# EAGLE board soundcard (EAGLE 6.5.0), part 1 of 3
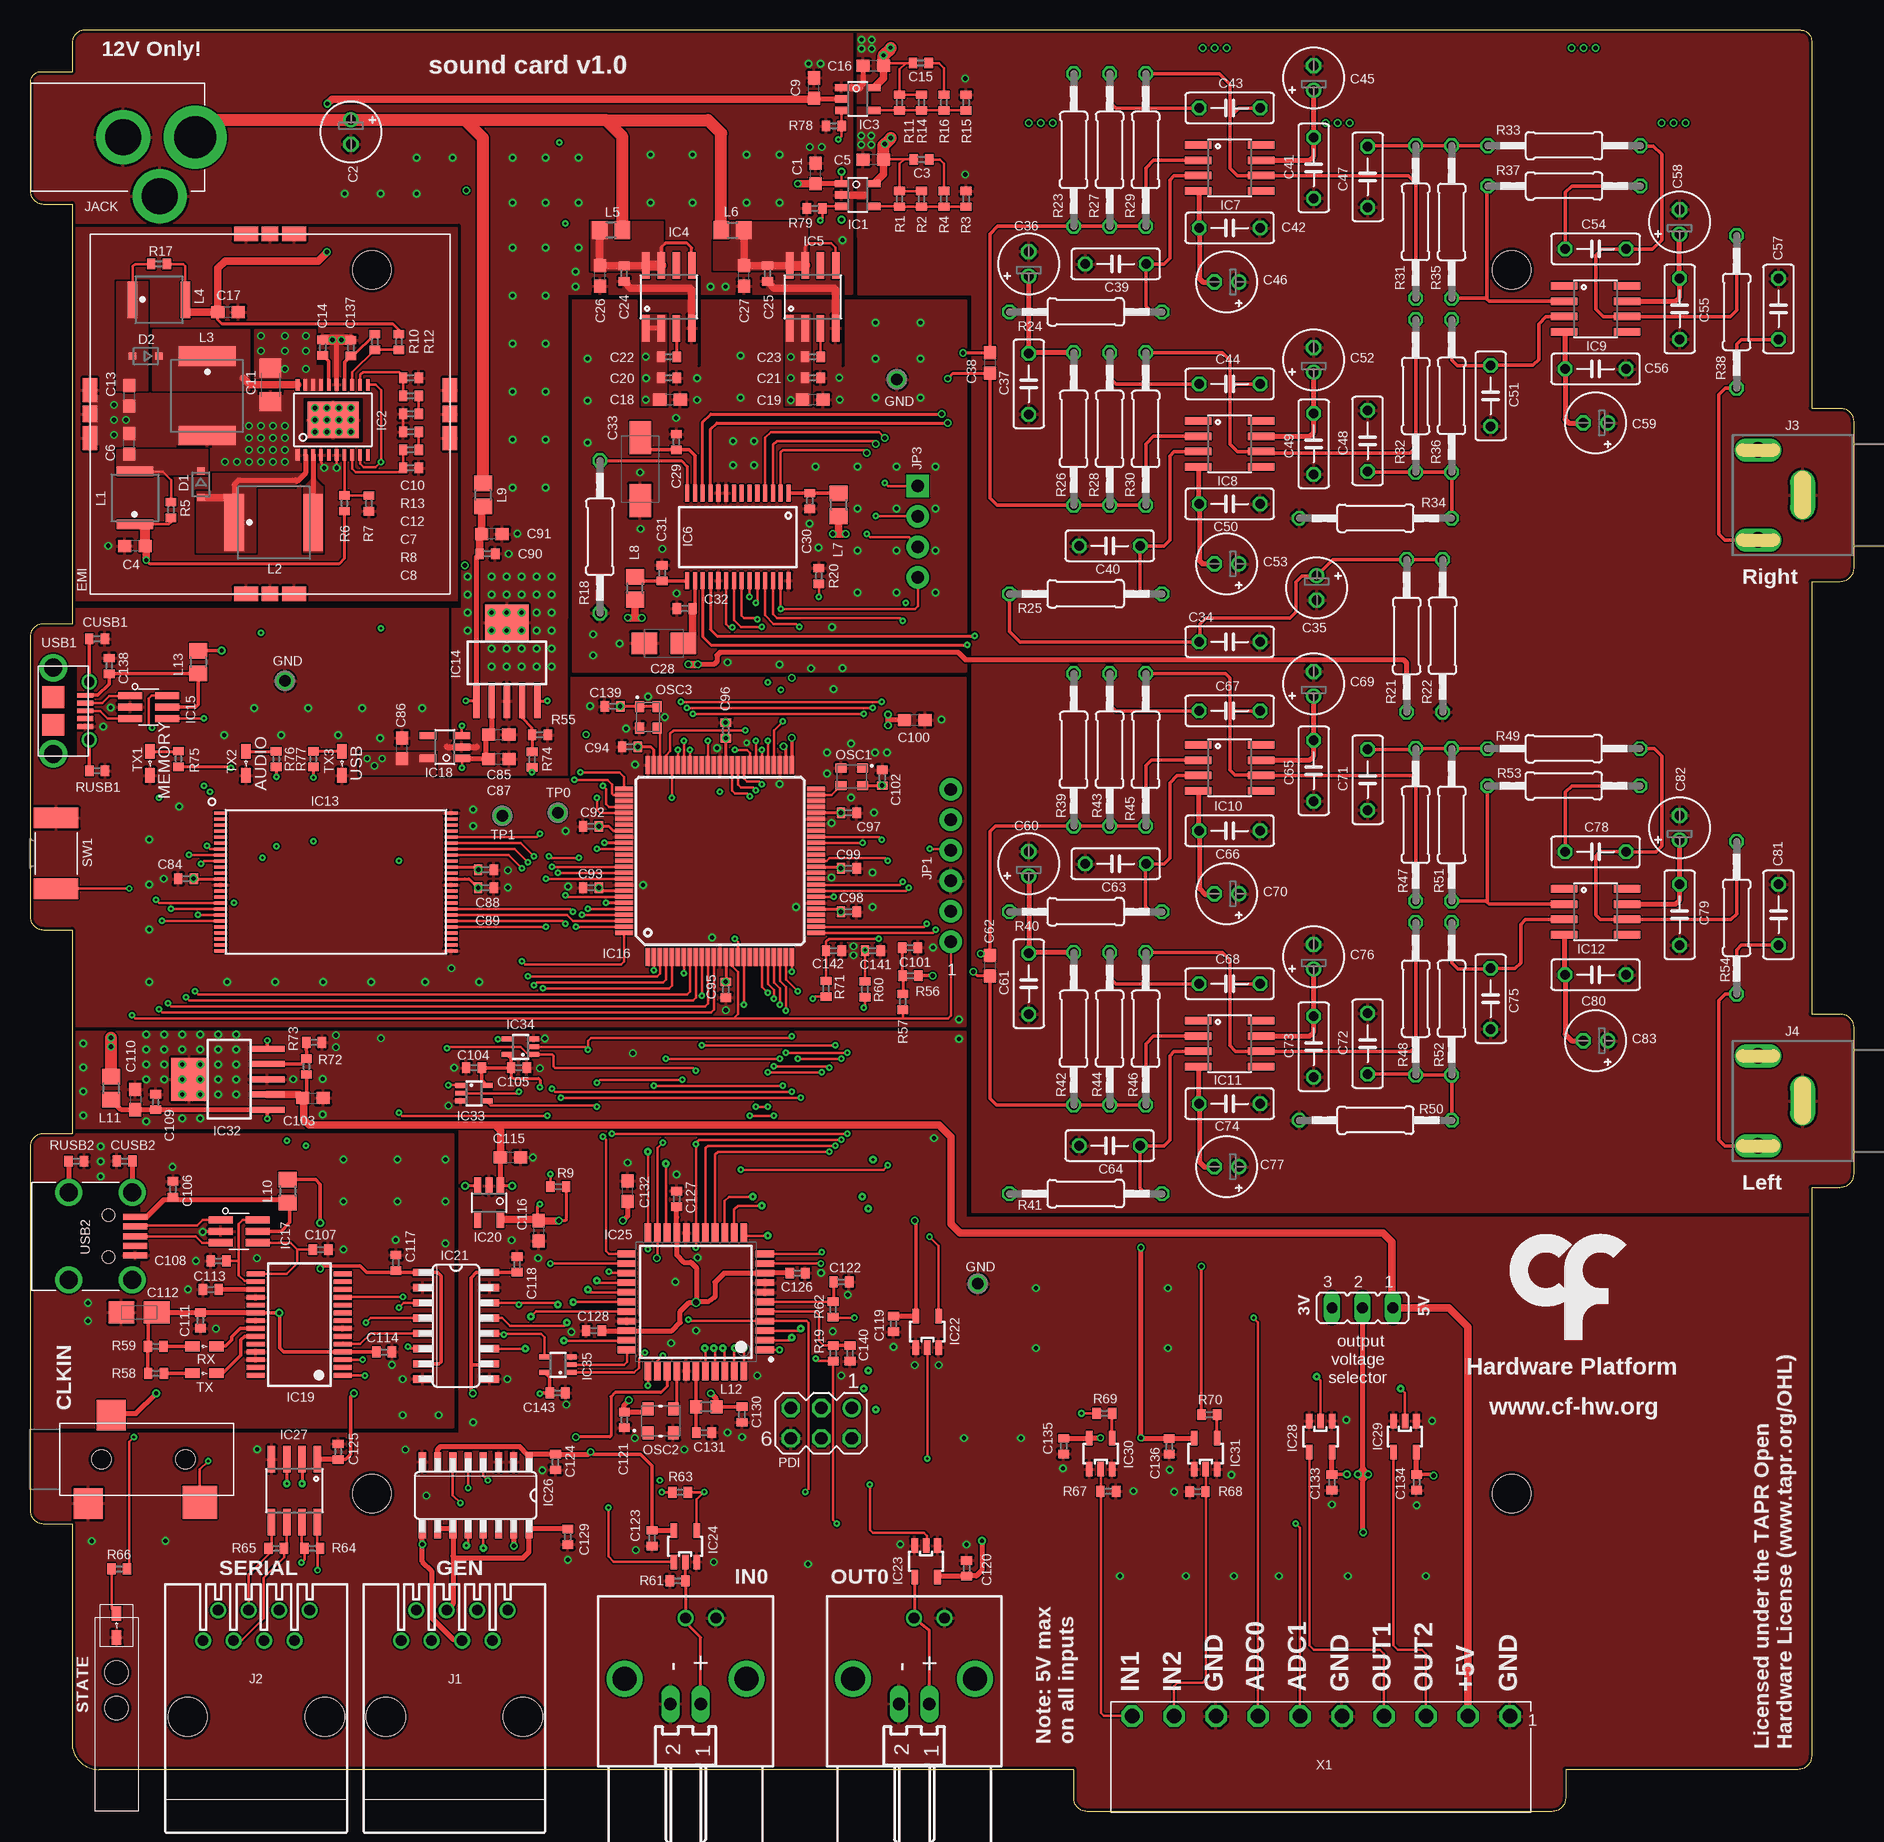
[diagram p8: board, top side]
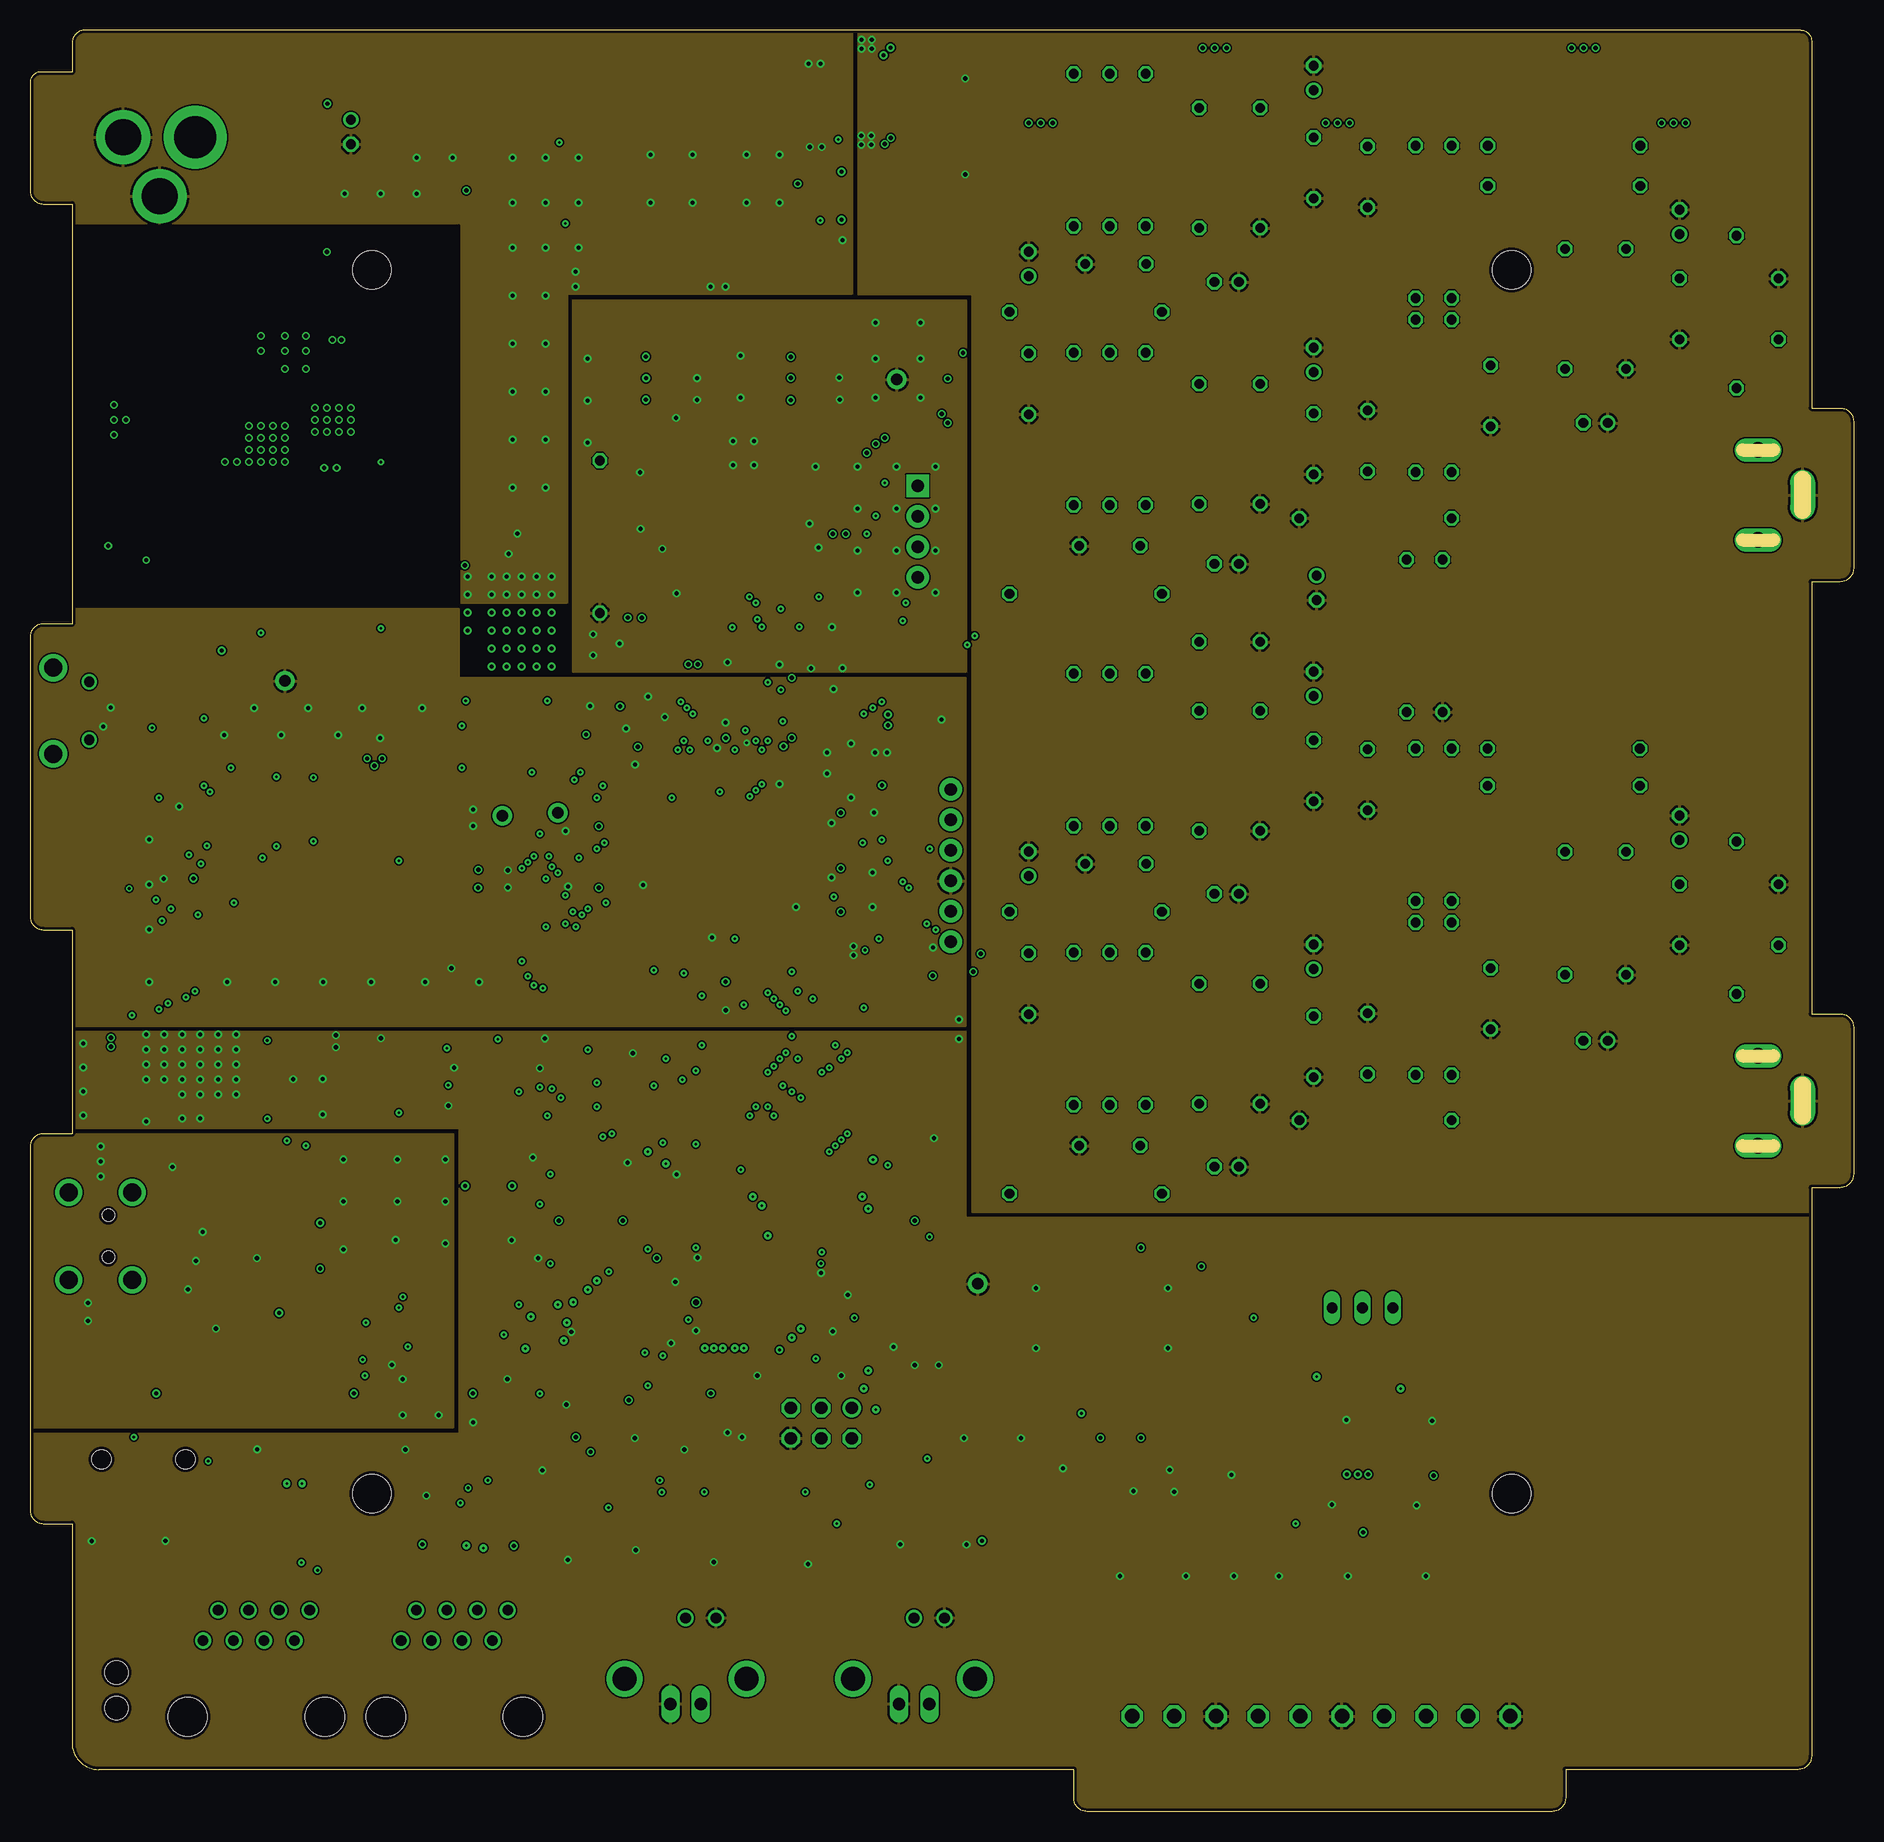
[diagram p9: board, inner layer Route2]
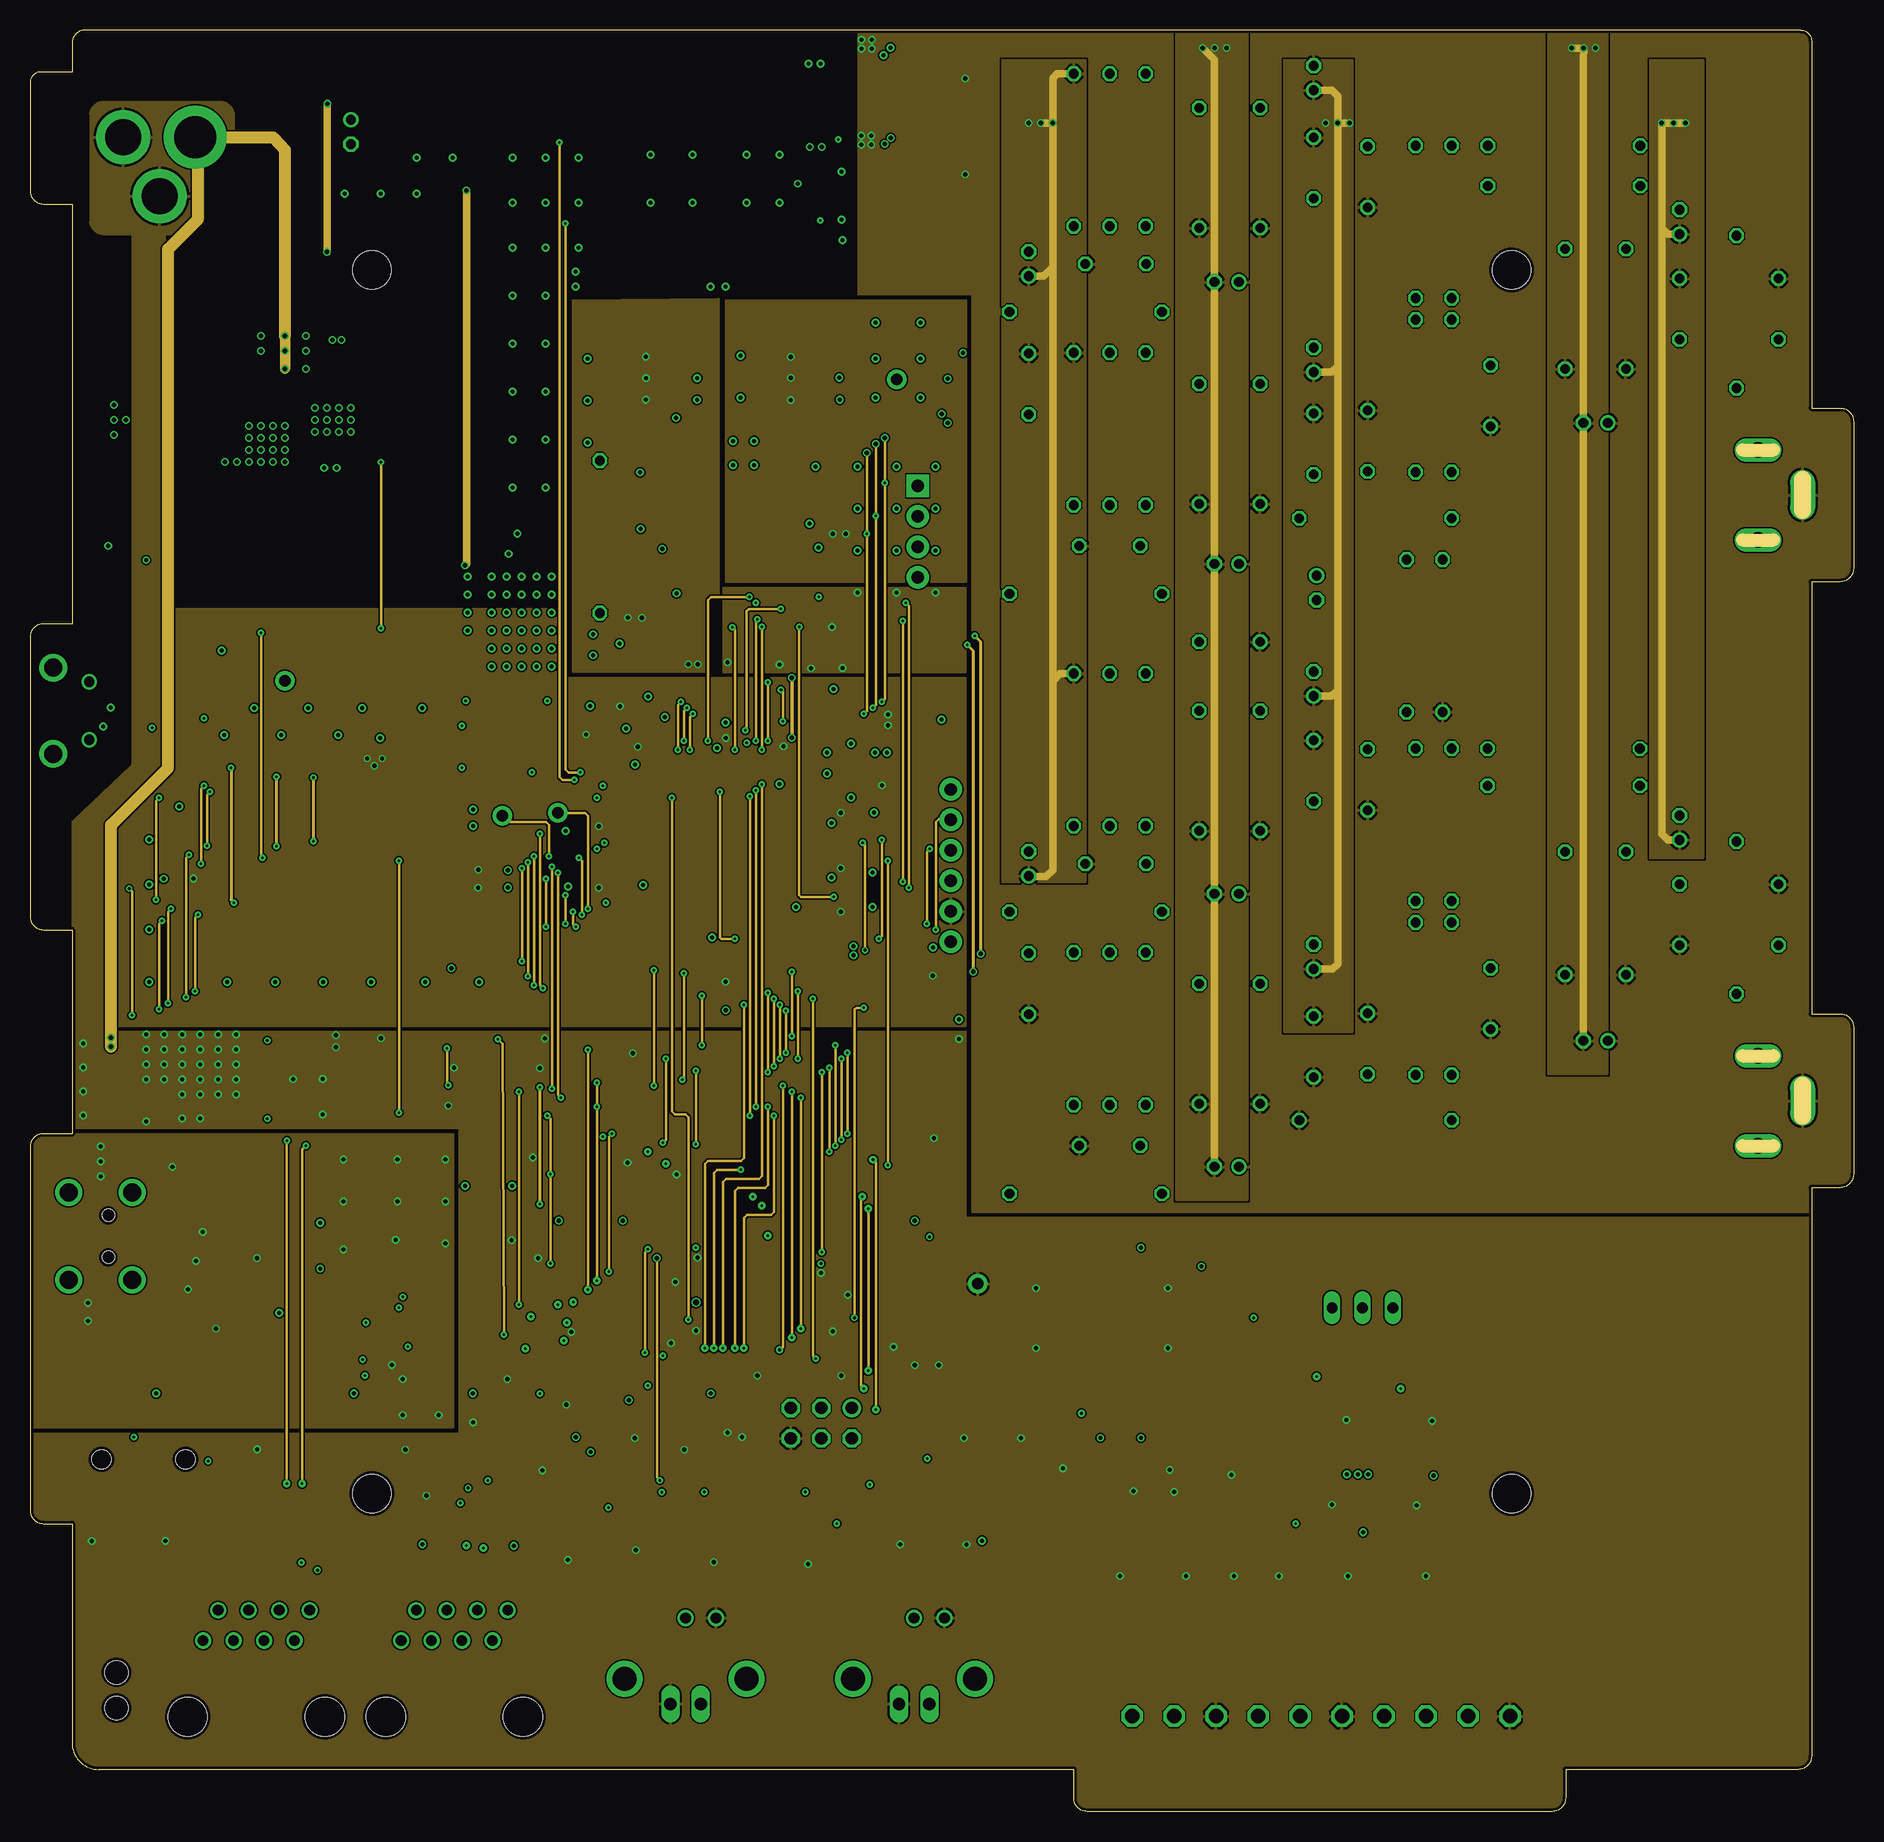
[diagram p10: board, inner layer Route3]
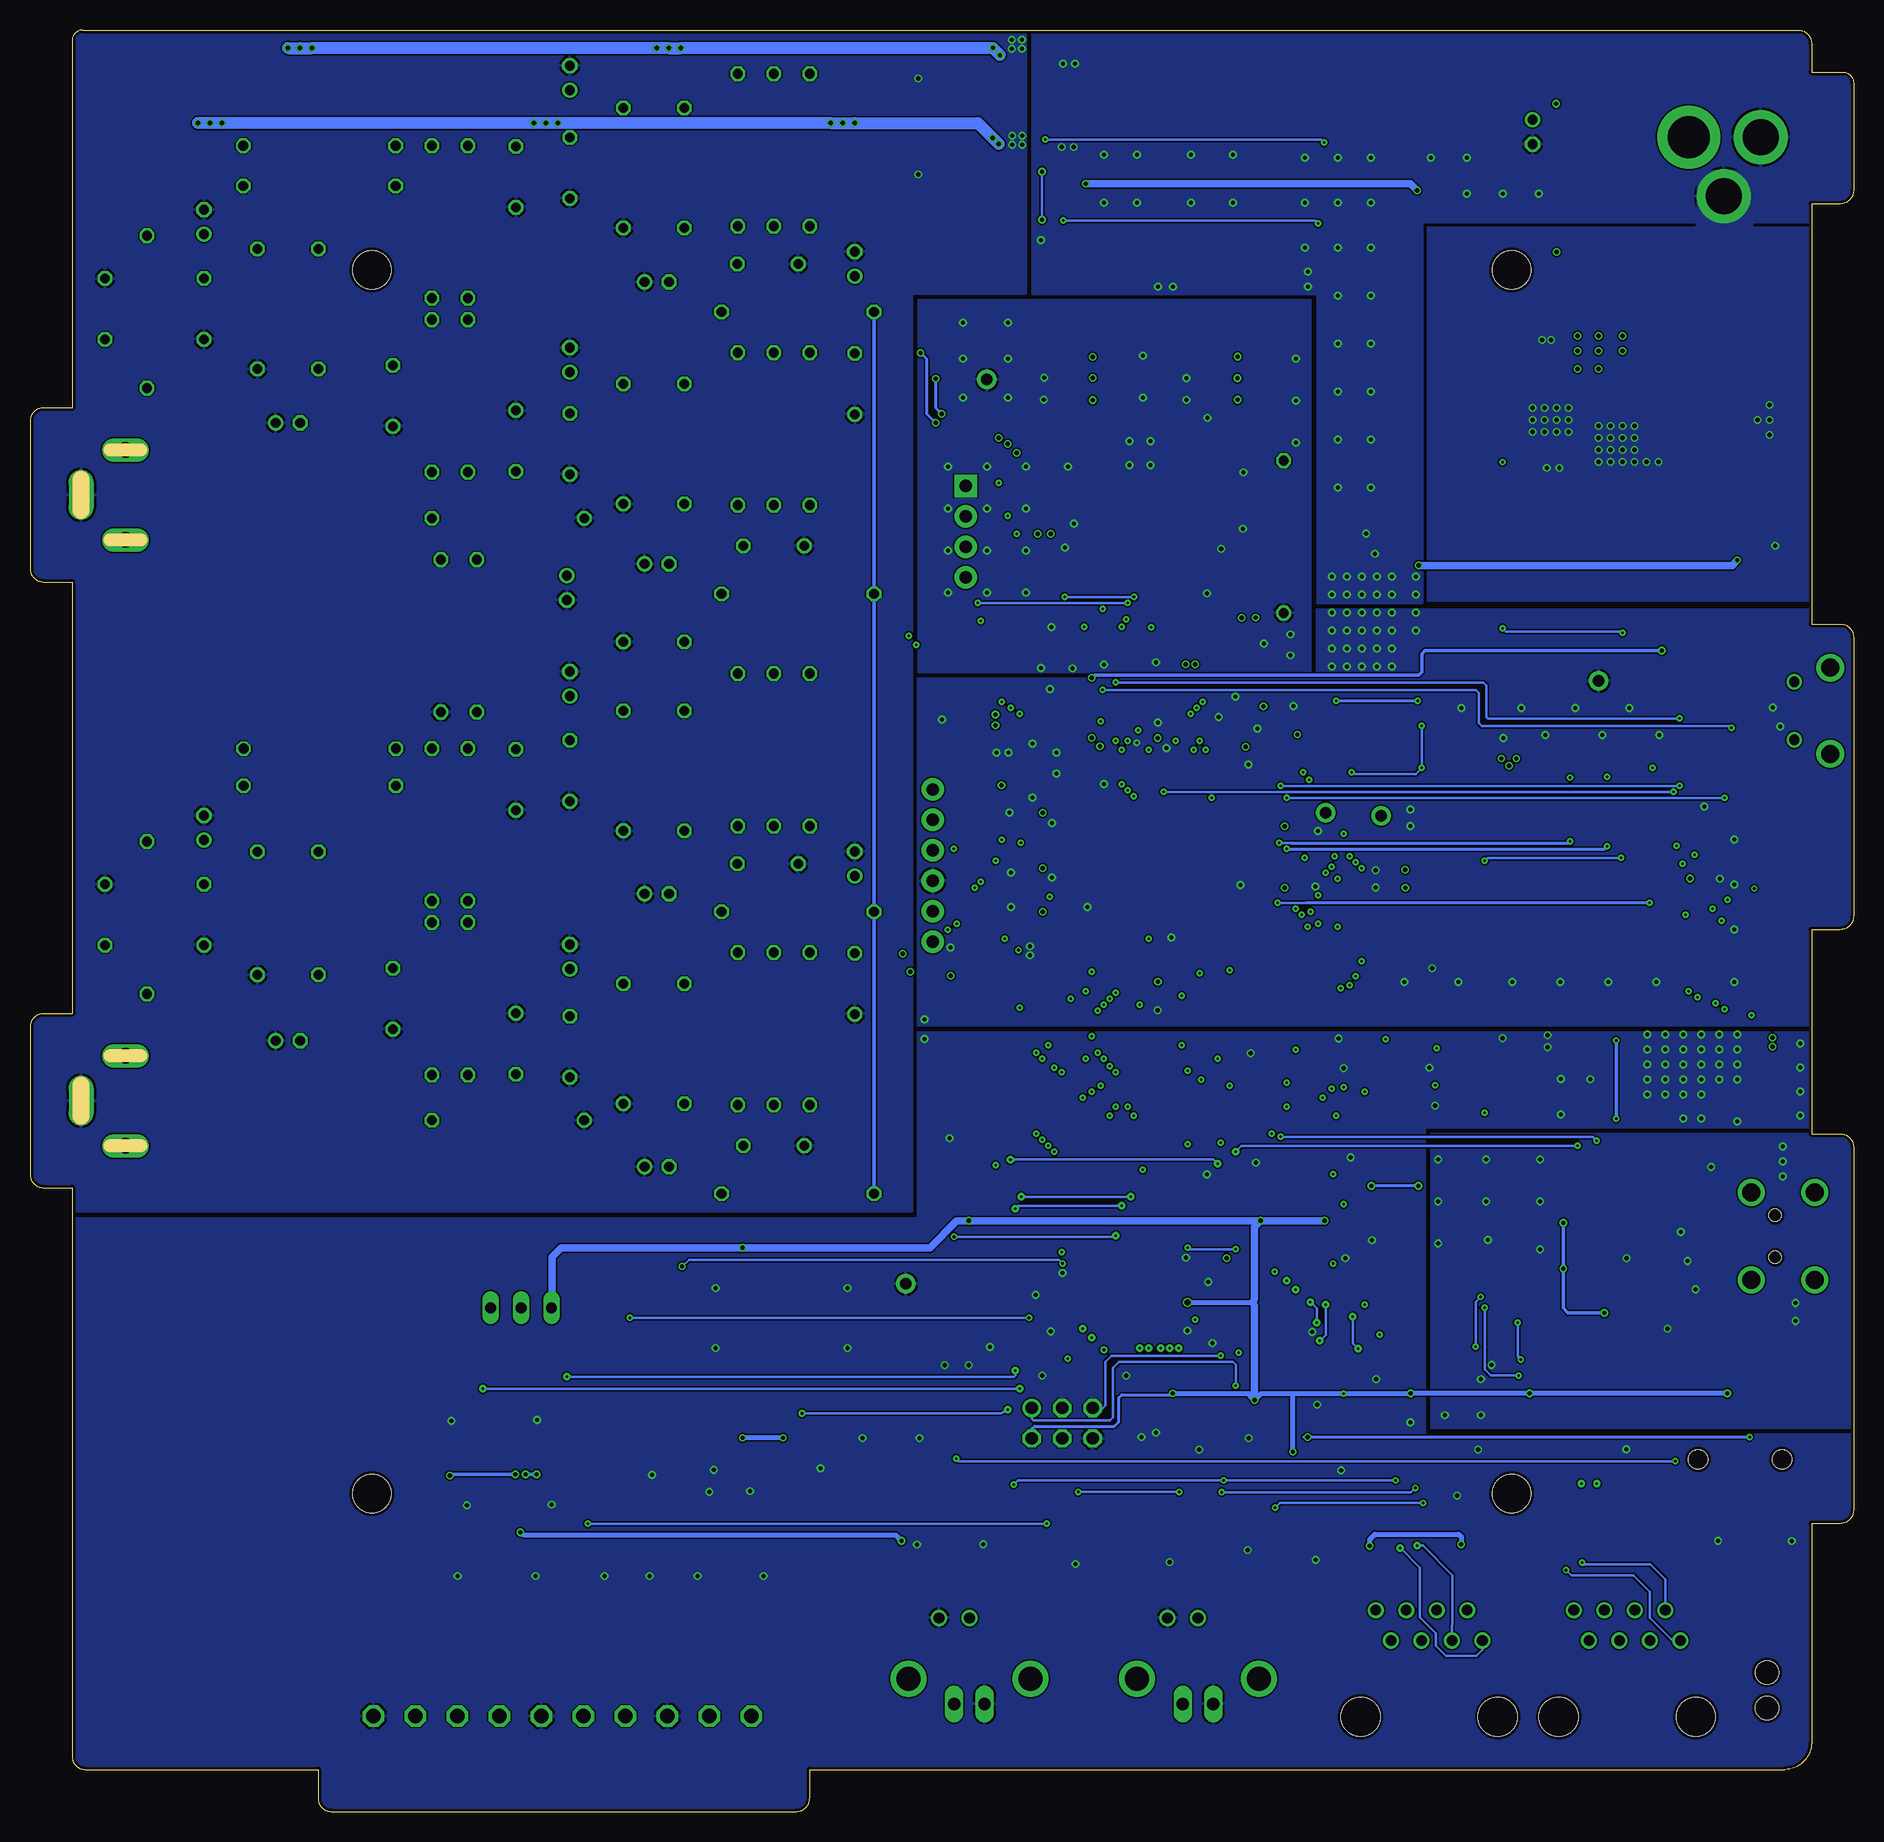
[diagram p11: board, bottom side, seen from below]

Size 152 x 148.5 mm. Coordinates in mm from the lower left corner, seen from the top.
Outline: 3.5,56.5 1.12,56.5 arc90 0,55.38 0,25.12 arc90 1.12,24 3.5,24 3.5,5.74 arc90 5.74,3.5 87,3.5 87,1.12 arc90 88.12,0 126.88,0 arc90 128,1.12 128,3.5 147.38,3.5 arc90 148.5,4.62 148.5,52 150.88,52 arc90 152,53.12 152,65.38 arc90 150.88,66.5 148.5,66.5 148.5,102.5 150.88,102.5 arc90 152,103.62 152,115.88 arc90 150.88,117 148.5,117 148.5,147.6 arc90 147.6,148.5 4.62,148.5 arc90 3.5,147.38 3.5,145 0.9,145 arc90 0,144.1 0,135.12 arc90 1.12,134 3.5,134 3.5,99 1.12,99 arc90 0,97.88 0,74.62 arc90 1.12,73.5 3.5,73.5 3.5,56.5
Copper layers (1+2*3+16): Top 0.018mm / dielectric 0.36mm / Route2 0.035mm / dielectric 0.71mm / Route3 0.035mm / dielectric 0.36mm / Bottom 0.018mm
Design rules "eC_4Layer_PClass7_BaseCopperO18-I35 *": minimum track width 0.125mm, minimum drill 0.15mm, track to track 0.125mm, track to pad 0.125mm, pad to pad 0.125mm, via to via 0.125mm, smd to smd 0mil, copper to edge 0.25mm, drill to drill 0.35mm, minimum pad ring 0.175mm, minimum via ring 0.125mm, stop-mask expansion 0mil, vias tented up to drill 0.45mm, thermal gap 0.2mm
Holes 3.2 mm at 28.5,26.5 123.5,26.5 28.5,128.5 123.5,128.5
tRestrict: 19 lines
bRestrict: 6 lines

## Footprints (pad centres in the part's own frame; a part is rotated, then mirrored left to right if it is on the bottom)
C0603 = smd 1.1 x 1: 1 -0.85,0; 2 0.85,0
E2-5 = drill 0.813 pad 1.27: + -1.016,0 | drill 0.813 pad 1.27 octagon: - 1.016,0
C0402 = smd 0.7 x 0.9: 1 -0.65,0; 2 0.65,0
C1206 = smd 1.6 x 1.8: 1 -1.4,0; 2 1.4,0
B/3528-21W = smd 2.15 x 1.8: + 1.625,0; - -1.625,0
C/6032-28W = smd 2.75 x 1.8: + 2.625,0; - -2.625,0
C050-025X075 = drill 0.813 octagon: 1 -2.54,0; 2 2.54,0
A/3216-18W = smd 2.15 x 1.8: + 1.475,0; - -1.475,0
35RASMT2BHNTRX = smd 2.4 x 2.55: 1 0.8,3.675; 5 -1.1,-3.675 | smd 2.9 x 2.75: 4 8.2,-3.575 | hole 1.6: 0,0; 7,0
SOD323-R = smd 0.6 x 0.6: A 1.1,0; C -1.1,0
S01-30300500 = smd 1.4 x 1.2: P$1 0,15; P$7 0,-15 | smd 1.2 x 1.4: P$2 -15,0; P$3 15,0 | smd 2 x 1.2: P$4 2,-15; P$5 -2,-15; P$6 2,15; P$8 -2,15 | smd 1.2 x 2: P$9 -15,2; P$10 -15,-2; P$11 15,2; P$12 15,-2
TP_1 = drill 0.925 pad 1.6: TP 0,0
TSOT23-5 = smd 0.6 x 1.05: 1 -0.95,-1.354; 2 0,-1.354; 3 0.95,-1.354; 4 0.95,1.354; 5 -0.95,1.354
TSSOP-EP-20 = smd 0.305 x 0.991: 1 -2.94,-2.918; 2 -2.29,-2.918; 3 -1.64,-2.918; 4 -0.99,-2.918; 5 -0.34,-2.918; 6 0.31,-2.918; 7 0.96,-2.918; 8 1.61,-2.918; 9 2.26,-2.918; 10 2.91,-2.918; 11 2.91,2.918; 12 2.26,2.918; 13 1.61,2.918; 14 0.96,2.918; 15 0.31,2.918; 16 -0.34,2.918; 17 -0.99,2.918; 18 -1.64,2.918; 19 -2.29,2.918; 20 -2.94,2.918 | smd 4.25 x 3.05: EPAD 0,0
SO08 = smd 0.61 x 2.21: 1 -1.905,-2.616; 2 -0.635,-2.616; 3 0.635,-2.616; 4 1.905,-2.616; 5 1.905,2.616; 6 0.635,2.616; 7 -0.635,2.616; 8 -1.905,2.616
SSOP28 = smd 0.348 x 1.397: P1 -4.225,-3.656; P2 -3.575,-3.656; P3 -2.925,-3.656; P4 -2.275,-3.656; P5 -1.625,-3.656; P6 -0.975,-3.656; P7 -0.325,-3.656; P8 0.325,-3.656; P9 0.975,-3.656; P10 1.625,-3.656; P11 2.275,-3.656; P12 2.925,-3.656; P13 3.575,-3.656; P14 4.225,-3.656; P15 4.225,3.656; P16 3.575,3.656; P17 2.925,3.656; P18 2.275,3.656; P19 1.625,3.656; P20 0.975,3.656; P21 0.325,3.656; P22 -0.325,3.656; P23 -0.975,3.656; P24 -1.625,3.656; P25 -2.275,3.656; P26 -2.925,3.656; P27 -3.575,3.656; P28 -4.225,3.656
TSOP-48 = smd 0.25 x 1.1: P1 -5.75,-9.6; P2 -5.25,-9.6; P3 -4.75,-9.6; P4 -4.25,-9.6; P5 -3.75,-9.6; P6 -3.25,-9.6; P7 -2.75,-9.6; P8 -2.25,-9.6; P9 -1.75,-9.6; P10 -1.25,-9.6; P11 -0.75,-9.6; P12 -0.25,-9.6; P13 0.25,-9.6; P14 0.75,-9.6; P15 1.25,-9.6; P16 1.75,-9.6; P17 2.25,-9.6; P18 2.75,-9.6; P19 3.25,-9.6; P20 3.75,-9.6; P21 4.25,-9.6; P22 4.75,-9.6; P23 5.25,-9.6; P24 5.75,-9.6; P25 5.75,9.6; P26 5.25,9.6; P27 4.75,9.6; P28 4.25,9.6; P29 3.75,9.6; P30 3.25,9.6; P31 2.75,9.6; P32 2.25,9.6; P33 1.75,9.6; P34 1.25,9.6; P35 0.75,9.6; P36 0.25,9.6; P37 -0.25,9.6; P38 -0.75,9.6; P39 -1.25,9.6; P40 -1.75,9.6; P41 -2.25,9.6; P42 -2.75,9.6; P43 -3.25,9.6; P44 -3.75,9.6; P45 -4.25,9.6; P46 -4.75,9.6; P47 -5.25,9.6; P48 -5.75,9.6
SOT223-6 = smd 0.508 x 2.87: P$1 -2.54,-3.175; P$2 -1.27,-3.175; P$3 0,-3.175; P$4 1.27,-3.175; P$5 2.54,-3.175 | smd 3.6 x 2.962: P$6 0,3.353
SOT23-6L = smd 0.6 x 2: P$1 -0.95,-1.55; P$2 0,-1.55; P$3 0.95,-1.55; P$4 0.95,1.55; P$5 0,1.55; P$6 -0.95,1.55
TQFP-100 = smd 1.5 x 0.35: 1 -8,6; 2 -8,5.5; 3 -8,5; 4 -8,4.5; 5 -8,4; 6 -8,3.5; 7 -8,3; 8 -8,2.5; 9 -8,2; 10 -8,1.5; 11 -8,1; 12 -8,0.5; 13 -8,0; 14 -8,-0.5; 15 -8,-1; 16 -8,-1.5; 17 -8,-2; 18 -8,-2.5; 19 -8,-3; 20 -8,-3.5; 21 -8,-4; 22 -8,-4.5; 23 -8,-5; 24 -8,-5.5; 25 -8,-6; 51 8,-6; 52 8,-5.5; 53 8,-5; 54 8,-4.5; 55 8,-4; 56 8,-3.5; 57 8,-3; 58 8,-2.5; 59 8,-2; 60 8,-1.5; 61 8,-1; 62 8,-0.5; 63 8,0; 64 8,0.5; 65 8,1; 66 8,1.5; 67 8,2; 68 8,2.5; 69 8,3; 70 8,3.5; 71 8,4; 72 8,4.5; 73 8,5; 74 8,5.5; 75 8,6 | smd 0.35 x 1.5: 26 -6,-8; 27 -5.5,-8; 28 -5,-8; 29 -4.5,-8; 30 -4,-8; 31 -3.5,-8; 32 -3,-8; 33 -2.5,-8; 34 -2,-8; 35 -1.5,-8; 36 -1,-8; 37 -0.5,-8; 38 0,-8; 39 0.5,-8; 40 1,-8; 41 1.5,-8; 42 2,-8; 43 2.5,-8; 44 3,-8; 45 3.5,-8; 46 4,-8; 47 4.5,-8; 48 5,-8; 49 5.5,-8; 50 6,-8; 76 6,8; 77 5.5,8; 78 5,8; 79 4.5,8; 80 4,8; 81 3.5,8; 82 3,8; 83 2.5,8; 84 2,8; 85 1.5,8; 86 1,8; 87 0.5,8; 88 0,8; 89 -0.5,8; 90 -1,8; 91 -1.5,8; 92 -2,8; 93 -2.5,8; 94 -3,8; 95 -3.5,8; 96 -4,8; 97 -4.5,8; 98 -5,8; 99 -5.5,8; 100 -6,8
TSOT23-5' = smd 0.6 x 1.408: 1 -0.95,-1.404; 2 0,-1.404; 3 0.95,-1.404; 4 0.95,1.404; 5 -0.95,1.404
SSOP28' = smd 0.4 x 1.5: 1 -4.225,-3.625; 2 -3.575,-3.625; 3 -2.925,-3.625; 4 -2.275,-3.625; 5 -1.625,-3.625; 6 -0.975,-3.625; 7 -0.325,-3.625; 8 0.325,-3.625; 9 0.975,-3.625; 10 1.625,-3.625; 11 2.275,-3.625; 12 2.925,-3.625; 13 3.575,-3.625; 14 4.225,-3.625; 15 4.225,3.625; 16 3.575,3.625; 17 2.925,3.625; 18 2.275,3.625; 19 1.625,3.625; 20 0.975,3.625; 21 0.325,3.625; 22 -0.325,3.625; 23 -0.975,3.625; 24 -1.625,3.625; 25 -2.275,3.625; 26 -2.925,3.625; 27 -3.575,3.625; 28 -4.225,3.625
NSOIC-16 = smd 0.6 x 1.55: 1 -4.437,-2.789; 2 -3.167,-2.789; 3 -1.897,-2.789; 4 -0.627,-2.789; 5 0.643,-2.789; 6 1.913,-2.789; 7 3.183,-2.789; 8 4.453,-2.789; 9 4.453,2.811; 10 3.183,2.811; 11 1.913,2.811; 12 0.643,2.811; 13 -0.627,2.811; 14 -1.897,2.811; 15 -3.167,2.811; 16 -4.437,2.811
SOT23-5 = smd 0.55 x 1.2: 1 -0.95,-1.3; 2 0,-1.3; 3 0.95,-1.3; 4 0.95,1.3; 5 -0.95,1.3
QFP80P1200X1200X120-44N = smd 1.55 x 0.55: 1 -5.75,4; 2 -5.75,3.2; 3 -5.75,2.4; 4 -5.75,1.6; 5 -5.75,0.8; 6 -5.75,0; 7 -5.75,-0.8; 8 -5.75,-1.6; 9 -5.75,-2.4; 10 -5.75,-3.2; 11 -5.75,-4; 23 5.75,-4; 24 5.75,-3.2; 25 5.75,-2.4; 26 5.75,-1.6; 27 5.75,-0.8; 28 5.75,0; 29 5.75,0.8; 30 5.75,1.6; 31 5.75,2.4; 32 5.75,3.2; 33 5.75,4 | smd 0.55 x 1.55: 12 -4,-5.75; 13 -3.2,-5.75; 14 -2.4,-5.75; 15 -1.6,-5.75; 16 -0.8,-5.75; 17 0,-5.75; 18 0.8,-5.75; 19 1.6,-5.75; 20 2.4,-5.75; 21 3.2,-5.75; 22 4,-5.75; 34 4,5.75; 35 3.2,5.75; 36 2.4,5.75; 37 1.6,5.75; 38 0.8,5.75; 39 0,5.75; 40 -0.8,5.75; 41 -1.6,5.75; 42 -2.4,5.75; 43 -3.2,5.75; 44 -4,5.75
SC-70-5 = smd 0.4 x 0.9: 1 -0.65,-1.1; 2 0,-1.1; 3 0.65,-1.1; 4 0.65,1.1; 5 -0.65,1.1
BNC_RA = drill 0.9 pad 1.27: 1 0,-5.08; 2 -2.54,-5.08 | drill 2: P$1 -5.08,0; P$2 5.08,0
7395-02 = drill 1.016 long: 1 1.27,0; 2 -1.27,0
520426-4 = drill 0.889: 1 -4.445,6.35; 2 -3.175,8.89; 3 -1.905,6.35; 4 -0.635,8.89; 5 0.635,6.35; 6 1.905,8.89; 7 3.175,6.35; 8 4.445,8.89 | hole 3.251: -5.715,0; 5.715,0
RCA = drill 1.4 long: P1 0,0 | drill 1.3 long: P2 3.7,3.75; P3 3.7,-3.75
DC_POWER_INPUT_2.1MM = drill 3.5: P1 8.5,0 | drill 3: P2 2.5,0; P3 5.55,-4.9
1X06_NO_SILK = drill 1.016 pad 1.88: 1 0,0; 2 2.54,0; 3 5.08,0; 4 7.62,0; 5 10.16,0; 6 12.7,0
JP2 = drill 0.914 long: 1 -2.54,0; 2 0,0; 3 2.54,0
1X04_NO_SILK = drill 1.016 pad 1.88 square: 1 0,0 | drill 1.016 pad 1.88: 2 2.54,0; 3 5.08,0; 4 7.62,0
IND_LPS4012 = smd 0.81 x 3.04: 1 -2.2,0; 2 2.2,0
IND_LPS6225 = smd 1.675 x 4.75: 1 -3.3,0 | smd 1.575 x 4.75: 2 3.3,0
R0805 = smd 1.3 x 1.5: 1 -0.95,0; 2 0.95,0
R0603 = smd 1 x 1.1: 1 -0.85,0; 2 0.85,0
CRYSTAL_2.5X2.0MM = smd 0.9 x 0.75: P$1 -0.9,-0.725; P$2 0.9,-0.725; P$3 0.9,0.725; P$4 -0.9,0.725
OSCILLATOR_3.2X2.5 = smd 0.9 x 1.1: P$1 -1.05,-1; P$2 1.05,-1; P$3 1.05,1; P$4 -1.05,1
MA03-2 = drill 1.016: 1 -2.54,-1.27 | drill 1.016 octagon: 2 -2.54,1.27; 3 0,-1.27; 4 0,1.27; 5 2.54,-1.27; 6 2.54,1.27
R0402 = smd 0.7 x 0.9: 1 -0.65,0; 2 0.65,0
0207/12 = drill 0.813 octagon: 1 -6.35,0; 2 6.35,0
LED_HAND = smd 1.2 x 0.8: A -1,0; K 1,0
SWITCH_KSS = smd 1.7 x 3.7: O -2.95,0; P 2.95,0
LED_PIPE_7513D2-L = hole 1.93: -1.486,0; 1.486,0
ZX62D-B-5P8 = smd 0.4 x 1.35: P$1 -1.3,2.675; P$2 -0.65,2.675; P$3 0,2.675; P$4 0.65,2.675; P$5 1.3,2.675 | smd 1.8 x 1.8: P$6 -1.15,0; P$7 1.15,0 | drill 1.5 pad 2.3: SHIELD_1 -3.6,0; SHIELD_2 3.6,0 | drill 0.85 pad 1.25: SHIELD_3 2.425,3; SHIELD_4 -2.425,3
240-0002-1 = smd 0.5 x 2: P$1 -1.6,8.65; P$2 -0.8,8.65; P$3 0,8.65; P$4 0.8,8.65; P$5 1.6,8.65 | drill 1.5: SHIELD_1 -3.65,3.1; SHIELD_2 3.65,3.1; SHIELD_3 3.65,8.4; SHIELD_4 -3.65,8.4 | hole 1: -1.75,6.4; 1.75,6.4
CON_3.5MM_1X10 = drill 1.2 octagon: P1 -15.75,0; P2 -12.25,0; P3 -8.75,0; P4 -5.25,0; P5 -1.75,0; P6 1.75,0; P7 5.25,0; P8 8.75,0; P9 12.25,0; P10 15.75,0

## Placement (x,y rotation side)
C1  2.2u  [C0603]  65.49,136.55 90 top
C2  68uF  [E2-5]  26.75,140 270 top
C3  1u  [C0402]  74.3,137.7 180 top
C4  1u  [C0603]  8.75,105.5 180 top
C5  2.2u  [C0603]  70.3,137.7 180 top
C6  1u  [C0603]  8.25,114 90 top
C7  820p  [C0402]  31.75,115 180 top
C8  47p  [C0402]  31.75,112 0 top
C9  2.2u  [C0603]  65.34,143.65 90 top
C10  68p  [C0402]  31.75,119.5 0 top
C11  10u  [C1206]  20.05,118.92 270 top
C12  6.8n  [C0402]  31.75,116.5 180 top
C13  1u  [C0603]  8.25,118 270 top
C14  1u  [C0402]  24.41,122.03 90 top
C15  100n  [C0402]  74.25,145.75 180 top
C16  2.2u  [C0603]  70.3,145.51 180 top
C17  1u  [C0603]  16.51,124.99 0 top
C18  10uF  [C0603]  53.35,117.68 180 top
C19  10uF  [C0603]  65.25,117.68 180 top
C20  100nF  [C0402]  53.25,119.5 180 top
C21  100nF  [C0402]  65.25,119.5 180 top
C22  10nF  [C0402]  53.25,121.25 180 top
C23  10nF  [C0402]  65.25,121.25 180 top
C24  100nF  [C0402]  49.52,128.2 90 top
C25  100nF  [C0402]  61.47,128.2 90 top
C26  10uF  [C0603]  47.5,128 90 top
C27  10uF  [C0603]  59.5,128 90 top
C28  10u  [B/3528-21W]  52.84,97.38 0 top
C29  100nF  [C0402]  53.88,114.16 90 top
C30  100nF  [C0402]  65,109.25 270 top
C31  100nF  [C0402]  52.7,103.23 90 top
C32  100nF  [C0402]  54.58,100.28 180 top
C33  47u  [C/6032-28W]  50.86,111.9 90 top
C34  100nF  [C050-025X075]  100,97.5 0 top
C35  47uF  [E2-5]  107.25,102 270 top
C36  4.7uF  [E2-5]  83.25,129 90 top
C37  100nF  [C050-025X075]  83.25,119 270 top
C38  100pF  [C0603]  80,120.75 270 top
C39  100nF  [C050-025X075]  90.5,129 180 top
C40  100nF  [C050-025X075]  90,105.5 180 top
C41  100nF  [C050-025X075]  107,137 270 top
C42  100nF  [C050-025X075]  100,132 180 top
C43  100pF  [C050-025X075]  100,142 0 top
C44  100pF  [C050-025X075]  100,119 0 top
C45  4.7uF  [E2-5]  107,144.5 90 top
C46  4.7uF  [E2-5]  99.75,127.5 180 top
C47  5.6nF  [C050-025X075]  111.5,136.25 270 top
C48  5.6nF  [C050-025X075]  111.5,114.25 90 top
C49  100nF  [C050-025X075]  107,114 270 top
C50  100nF  [C050-025X075]  100,109 180 top
C51  2.7nF  [C050-025X075]  121.75,118 270 top
C52  4.7uF  [E2-5]  107,121 90 top
C53  4.7uF  [E2-5]  99.75,104 180 top
C54  2.7nF  [C050-025X075]  130.5,130.25 0 top
C55  100nF  [C050-025X075]  137.5,125.25 270 top
C56  100nF  [C050-025X075]  130.5,120.25 180 top
C57  3.9nF  [C050-025X075]  145.75,125.25 90 top
C58  4.7uF  [E2-5]  137.5,132.5 90 top
C59  4.7uF  [E2-5]  130.5,115.75 180 top
C60  4.7uF  [E2-5]  83.25,79 90 top
C61  100nF  [C050-025X075]  83.25,69 270 top
C62  100pF  [C0603]  80,70.5 270 top
C63  100nF  [C050-025X075]  90.5,79 180 top
C64  100nF  [C050-025X075]  90,55.5 180 top
C65  100nF  [C050-025X075]  107,86.75 270 top
C66  100nF  [C050-025X075]  100,81.75 180 top
C67  100pF  [C050-025X075]  100,91.75 0 top
C68  100pF  [C050-025X075]  100,69 0 top
C69  4.7uF  [E2-5]  107,94 90 top
C70  4.7uF  [E2-5]  99.75,76.5 180 top
C71  5.6nF  [C050-025X075]  111.5,86 270 top
C72  5.6nF  [C050-025X075]  111.5,64 90 top
C73  100nF  [C050-025X075]  107,63.75 270 top
C74  100nF  [C050-025X075]  100,59 180 top
C75  2.7nF  [C050-025X075]  121.75,67.75 270 top
C76  4.7uF  [E2-5]  107,71.25 90 top
C77  4.7uF  [E2-5]  99.75,53.75 180 top
C78  2.7nF  [C050-025X075]  130.5,80 0 top
C79  100nF  [C050-025X075]  137.5,74.75 270 top
C80  100nF  [C050-025X075]  130.5,69.75 180 top
C81  3.9nF  [C050-025X075]  145.75,74.75 90 top
C82  4.7uF  [E2-5]  137.5,82 90 top
C83  4.7uF  [E2-5]  130.5,64.25 180 top
C84  100nF  [C0402]  13,77.75 180 top
C85  10uF  [C0603]  39.07,89.77 0 top
C86  10uF  [C0603]  31.02,88.63 90 top
C87  10uF  [C0603]  39.08,87.74 0 top
C88  100nF  [C0402]  38,78.5 0 top
C89  100nF  [C0402]  38,77 0 top
C90  100nF  [C0402]  38.13,104.84 180 top
C91  10uF  [C0603]  38.5,106.5 180 top
C92  100nF  [C0402]  46.75,82.12 180 top
C93  100nF  [C0402]  46.75,77 180 top
C94  100nF  [C0402]  50,88.75 180 top
C95  100nF  [C0402]  58,68.5 270 top
C96  100nF  [C0402]  58,90.12 90 top
C97  100nF  [C0402]  68.25,83.25 0 top
C98  100nF  [C0402]  68.25,75 0 top
C99  100nF  [C0402]  68.25,78.62 0 top
C100  10uF  [C0603]  73.75,91 0 top
C101  100nF  [C0402]  73.36,72.01 0 top
C102  100nF  [C0402]  71.05,86.17 90 top
C103  10uF  [C0603]  23.59,59.46 0 top
C104  100nF  [C0402]  37,62 180 top
C105  100nF  [C0402]  40.75,62 0 top
C106  100nF  [C0402]  11.92,51.88 90 top
C107  47pF  [C0402]  24.22,46.84 0 top
C108  47pF  [C0402]  15.71,45.9 180 top
C109  100nF  [C0402]  10.48,59.14 270 top
C110  10uF  [C0603]  8.78,59.35 270 top
C111  100nF  [C0402]  14.21,40.93 270 top
C112  4.7uF  [A/3216-18W]  9.09,41.61 0 top
C113  100nF  [C0402]  15.08,43.51 180 top
C114  100nF  [C0402]  29.53,38.3 0 top
C115  10uF  [C0603]  40.05,54.54 0 top
C116  10uF  [C0603]  42.39,48.41 270 top
C117  100nF  [C0402]  30.5,45.75 90 top
C118  100nF  [C0402]  40.61,45.59 90 top
C119  100nF  [C0402]  71.97,40.64 270 top
C120  100nF  [C0402]  78.07,20.27 90 top
C121  100nF  [C0402]  49.54,32.64 270 top
C122  100nF  [C0402]  67.63,44.14 0 top
C123  100nF  [C0402]  51.85,22.79 270 top
C124  100nF  [C0402]  43.8,29.13 270 top
C125  100nF  [C0402]  25.7,29.99 90 top
C126  100nF  [C0402]  63.97,44.88 0 top
C127  100nF  [C0402]  53.9,51.07 90 top
C128  100nF  [C0402]  47.01,40.08 180 top
C129  100nF  [C0402]  44.83,22.91 270 top
C130  330nF  [C0402]  59.35,33.09 270 top
C131  330nF  [C0402]  56.19,31.59 0 top
C132  10uF  [C0603]  49.82,51.7 90 top
C133  100nF  [C0402]  108.52,27.44 270 top
C134  100nF  [C0402]  115.58,27.44 270 top
C135  100nF  [C0402]  86.16,30.46 270 top
C136  100nF  [C0402]  94.96,30.43 270 top
C137  1u  [C0402]  26.75,122 90 top
C138  100nF  [C0402]  6.6,95.5 90 top
C139  100nF  [C0402]  48.55,92.12 180 top
C140  100nF  [C0402]  68.35,38.19 270 top
C141  100nF  [C0402]  70.25,71.75 0 top
C142  100nF  [C0402]  67,71.75 0 top
C143  100nF  [C0402]  43.98,34.89 0 top
CLKIN  [35RASMT2BHNTRX]  5.96,29.36 0 top
CUSB1  4.7nF  [C0402]  5.59,97.74 0 top
CUSB2  4.7nF  [C0402]  7.88,54.22 180 top
D1  [SOD323-R]  14.25,110.62 270 top
D2  [SOD323-R]  9.65,121.31 180 top
EMI  S01-30300500  [S01-30300500]  20,116.5 90 top
GND  TP  [TP_1]  72.25,119.38 0 top
GND174  TP  [TP_1]  79,44 0 top
GND176  TP  [TP_1]  21.25,94.25 0 top
IC1  ADP7118  [TSOT23-5]  69,134.75 270 top
IC2  ADP5070EP  [TSSOP-EP-20]  25.25,116 0 top
IC3  ADP7182  [TSOT23-5]  69,142.75 270 top
IC4  ADP3303  [SO08]  53.25,126.25 0 top
IC5  ADP3303  [SO08]  65.25,126.25 0 top
IC6  AD1955  [SSOP28]  59,106.25 180 top
IC7  AD797  [SO08]  100,137 270 top
IC8  AD797  [SO08]  100,114 270 top
IC9  AD797  [SO08]  130.5,125.25 270 top
IC10  AD797  [SO08]  100,87 270 top
IC11  AD797  [SO08]  100,64 270 top
IC12  AD797  [SO08]  130.5,75 270 top
IC13  S34ML  [TSOP-48]  25.5,77.5 270 top
IC14  TPS73801  [SOT223-6]  39.75,95.75 0 top
IC15  USBLC6-2SC6  [SOT23-6L]  9.9,92.06 270 top
IC16  PIC32MZ2048EFM100  [TQFP-100]  57.5,79.25 90 top
IC17  USBLC6-2SC6  [SOT23-6L]  17.44,48.36 270 top
IC18  LP5907MFX-3.3  [TSOT23-5']  34.58,88.73 90 top
IC19  FT232RL  [SSOP28']  22.45,40.59 90 top
IC20  LP5907MFX-3.3  [TSOT23-5']  38.27,50.74 180 top
IC21  SI8642BC-B-IS1  [NSOIC-16]  35.5,40.5 270 top
IC22  SN74LVC1G125  [SOT23-5]  74.79,39.98 0 top
IC23  SN74LVC1G125  [SOT23-5]  74.7,20.86 180 top
IC24  SN74LVC1G125  [SOT23-5]  54.62,22.11 0 top
IC25  ATXMEGAxxxA4U-AU  [QFP80P1200X1200X120-44N]  55.5,42.48 180 top
IC26  SI8645  [NSOIC-16]  37.16,26.36 180 top
IC27  SN65HVD  [SO08]  22.04,26.74 180 top
IC28  M74VHC1GT50DTT1G  [SOT23-5]  107.58,31.25 180 top
IC29  M74VHC1GT50DTT1G  [SOT23-5]  114.61,31.25 180 top
IC30  SN74LVC1G125  [SOT23-5]  89.25,29.83 0 top
IC31  SN74LVC1G125  [SOT23-5]  98,29.83 0 top
IC32  TPS73801  [SOT223-6]  16.61,61.03 90 top
IC33  VHC1GT126  [SC-70-5]  37,59.88 270 top
IC34  VHC1GT126  [SC-70-5]  40.88,63.75 90 top
IC35  VHC1GT125  [SC-70-5]  44,37.25 90 top
IN  BNC  [BNC_RA]  54.65,11.05 180 top
IN1  [7395-02]  54.65,8.96 0 top
J1  Port 1  [520426-4]  35.38,7.9 0 top
J2  Port 1  [520426-4]  18.87,7.9 0 top
J3  RCARCA  [RCA]  147.75,109.75 180 top
J4  RCARCA  [RCA]  147.75,59.25 180 top
JACK  DC_JACK2.1MM  [DC_POWER_INPUT_2.1MM]  5.25,139.55 0 top
JP1  [1X06_NO_SILK]  76.75,72.5 90 top
JP2  [JP2]  111.08,41.98 180 top
JP3  NA  [1X04_NO_SILK]  74,110.5 270 top
L1  1.5u  [IND_LPS4012]  8.75,109.5 90 top
L2  [IND_LPS6225]  20.32,107.42 0 top
L3  [IND_LPS6225]  14.75,118 270 top
L4  1.5u  [IND_LPS4012]  10.75,126 0 top
L5  600@100M  [R0805]  48.43,131.81 180 top
L6  600@100M  [R0805]  58.57,131.81 0 top
L7  600@100M  [R0805]  67.41,108.93 90 top
L8  600@100M  [R0805]  50.43,101.97 90 top
L9  600@100M  [R0805]  37.75,109.75 270 top
L10  ???  [R0805]  21.48,51.72 270 top
L11  600@100M  [R0805]  6.75,60.3 270 top
L12  1u  [R0603]  56.36,33.74 0 top
L13  ???  [R0805]  14.03,95.81 270 top
OSC1  OSCILLATOR2.5X2.0MM  [CRYSTAL_2.5X2.0MM]  68.5,86.25 180 top
OSC2  [OSCILLATOR_3.2X2.5]  52.57,32.56 0 top
OSC3  XOSC_2.5X2.0MM  [CRYSTAL_2.5X2.0MM]  51.54,91.21 270 top
OUT  BNC  [BNC_RA]  73.69,11.05 180 top
OUT1  [7395-02]  73.69,8.96 0 top
PDI  [MA03-2]  65.96,32.37 180 top
R1  180k  [R0402]  72.48,134.42 270 top
R2  180k  [R0402]  74.31,134.42 270 top
R3  10k  [R0402]  78.03,134.42 90 top
R4  10k  [R0402]  76.18,134.42 90 top
R5  6.04  [R0402]  11.75,108.5 270 top
R6  63.4k  [R0402]  26.21,109.05 270 top
R7  3.57k  [R0402]  28.25,109.04 270 top
R8  8.45k  [R0402]  31.75,113.5 0 top
R9  100k  [R0402]  44.04,52.08 0 top
R10  2.8k  [R0402]  28.75,122.5 270 top
R11  150k  [R0402]  72.48,142.45 270 top
R12  54.9k  [R0402]  30.75,122.5 270 top
R13  5.76k  [R0402]  31.75,118 180 top
R14  215k  [R0402]  74.31,142.45 270 top
R15  10k  [R0402]  78.03,142.45 90 top
R16  10k  [R0402]  76.18,142.45 90 top
R17  5.36  [R0402]  10.75,129 180 top
R18  2.49k  [0207/12]  47.5,106.25 90 top
R19  3.16k  [R0402]  66.95,38.19 90 top
R20  100k  [R0402]  65.75,103 90 top
R21  2.21k  [0207/12]  114.75,98 270 top
R22  2.80k  [0207/12]  117.75,98 90 top
R23  2k  [0207/12]  87,138.5 90 top
R24  806  [0207/12]  88,125 180 top
R25  806  [0207/12]  88,101.5 180 top
R26  2k  [0207/12]  87,115.25 90 top
R27  100  [0207/12]  90,138.5 90 top
R28  100  [0207/12]  90,115.25 90 top
R29  2.0k  [0207/12]  93,138.5 90 top
R30  2.0k  [0207/12]  93,115.25 90 top
R31  681  [0207/12]  115.5,132.5 90 top
R32  681  [0207/12]  115.5,118 270 top
R33  226  [0207/12]  127.87,138.85 0 top
R34  226  [0207/12]  112.15,107.8 0 top
R35  324  [0207/12]  118.5,132.5 270 top
R36  324  [0207/12]  118.5,118 90 top
R37  100  [0207/12]  127.87,135.5 0 top
R38  332  [0207/12]  142.25,125 270 top
R39  2k  [0207/12]  87,88.5 90 top
R40  806  [0207/12]  88,75 180 top
R41  806  [0207/12]  88,51.5 180 top
R42  2k  [0207/12]  87,65.25 90 top
R43  100  [0207/12]  90,88.5 90 top
R44  100  [0207/12]  90,65.25 90 top
R45  2.0k  [0207/12]  93,88.5 90 top
R46  2.0k  [0207/12]  93,65.25 90 top
R47  681  [0207/12]  115.5,82.25 90 top
R48  681  [0207/12]  115.5,67.75 270 top
R49  226  [0207/12]  127.85,88.6 0 top
R50  226  [0207/12]  112.15,57.62 0 top
R51  324  [0207/12]  118.5,82.25 270 top
R52  324  [0207/12]  118.5,67.75 90 top
R53  100  [0207/12]  127.85,85.5 0 top
R54  332  [0207/12]  142.25,74.5 270 top
R55  3.16k  [R0402]  42.5,89.75 180 top
R56  10k  [R0402]  73.39,69.67 0 top
R57  1k  [R0402]  72.75,67.5 90 top
R58  2050 NA  [R0402]  10.5,36.53 180 top
R59  680 NA  [R0402]  10.48,38.77 180 top
R60  3.16k  [R0402]  69.59,68.54 90 top
R61  100k  [R0402]  53.98,19.23 180 top
R62  3.16k  [R0402]  66.94,41.84 90 top
R63  1k  [R0402]  54.2,26.61 180 top
R64  100 NA  [R0402]  23.54,21.94 0 top
R65  100 NA  [R0402]  20.53,21.94 0 top
R66  68  [R0402]  7.44,20.22 0 top
R67  100k  [R0402]  89.88,26.7 0 top
R68  100k  [R0402]  97.33,26.67 180 top
R69  33  [R0402]  89.56,33.19 180 top
R70  33  [R0402]  98.3,33.08 180 top
R71  3.16k  [R0402]  66.35,68.58 90 top
R72  3.16k  [R0402]  23.68,64.11 180 top
R73  9.76k  [R0402]  23.04,62.09 270 top
R74  9.76k  [R0402]  41.85,87.7 270 top
R75  2050  [R0402]  12.38,87.75 270 top
R76  2050  [R0402]  20.53,87.72 270 top
R77  2050  [R0402]  23.62,87.73 270 top
R78  10k  [R0402]  67,140.5 180 top
R79  10k  [R0402]  65.41,133.63 180 top
RUSB1  1M  [R0402]  5.6,86.75 0 top
RUSB2  1M  [R0402]  3.87,54.2 0 top
RX  GREEN NA  [LED_HAND]  14.53,38.77 0 top
STATE  GREEN  [LED_HAND]  7.21,15.51 270 top
SW1  SW1"  [SWITCH_KSS]  2.17,79.88 90 top
TP0  TP  [TP_1]  44,83.25 0 top
TP1  TP  [TP_1]  39.38,83 0 top
TX  RED NA  [LED_HAND]  14.53,36.53 0 top
TX1  RED  [LED_HAND]  10,87.38 270 top
TX2  RED  [LED_HAND]  18,87.38 270 top
TX3  RED  [LED_HAND]  26,87.38 270 top
U$1  [LED_PIPE_7513D2-L]  7.21,10.11 90 top
U$9  [LOGO_6]  126.52,45.05 0 top
USB1  USB_MICRO_B  [ZX62D-B-5P8]  1.94,91.75 270 top
USB2  [240-0002-1]  0.13,47.96 270 top
X1  CON_3.5MM_1X10  [CON_3.5MM_1X10]  107.61,7.95 180 top